# EAGLE schematic supply (EAGLE 7.4.0)
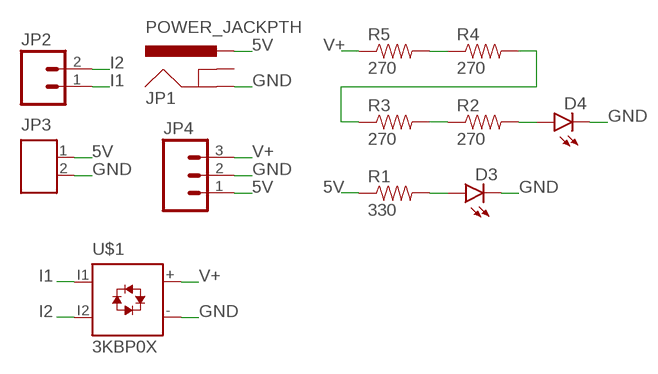
[diagram p0: schematic, sheet 1]

## Parts
D3  LED10MM  [LED10MM]
D4  LED10MM  [LED10MM]
JP1  POWER_JACKPTH  [POWER_JACK_PTH]
JP2  M025MM  [SCREWTERMINAL-5MM-2]
JP3  M02  [JST-2-PTH]
JP4  M03LONGPADS  [1X03_LONGPADS]
R1  330  1KOHM-1/4W-5%(PTH)HORIZ-KIT  [AXIAL-0.3EZ]
R2  270  1KOHM-1/4W-5%(PTH)HORIZ-KIT  [AXIAL-0.3EZ]
R3  270  1KOHM-1/4W-5%(PTH)HORIZ-KIT  [AXIAL-0.3EZ]
R4  270  1KOHM-1/4W-5%(PTH)HORIZ-KIT  [AXIAL-0.3EZ]
R5  270  1KOHM-1/4W-5%(PTH)HORIZ-KIT  [AXIAL-0.3EZ]
U$1  3KBP0X  [3KBP0X]

## Nets
5V: JP1.PWR JP3.1 JP4.1 R1.P$1
GND: D3.C D4.C JP1.GND JP3.2 JP4.2 U$1.-
I1: JP2.1 U$1.I1
I2: JP2.2 U$1.I2
N$1: R2.P$1 R3.P$2
N$2: R3.P$1 R4.P$2
N$3: D4.A R2.P$2
N$4: D3.A R1.P$2
N$5: R4.P$1 R5.P$2
V+: JP4.3 R5.P$1 U$1.+
Unconnected: JP1.GNDBREAK

## Library data of the parts
D3 D4 = SparkFun-LED:LED: LEDs Standard schematic elements and footprints for 5mm, 3mm, 1206, and 0603 sized LEDs. 5mm - Spark Fun Electronics SKU : COM-00529 (and others)
JP1 = SparkFun-Connectors:POWER_JACK: Power Jack This is the standard 5.5mm barrel jack for power. The PTH is the most common, proven, reliable, footprint. The Slot footprint only works if the mill layer is transmitted to the PCB fab house so be warned. Mating wall wart : TOL-00298 (and others); PROD_ID: CONN-08197
JP2 = SparkFun-Connectors:M02: Standard 2-pin 0.1" header. Use with - straight break away headers ( PRT-00116) - right angle break away headers (PRT-00553) - swiss pins (PRT-00743) - machine pins (PRT-00117) - female headers (PRT-00115) Molex polarized connector foot print use with: PRT-08233 with associated crimp pins and housings. 2.54_SCREWTERM for use with PRT-10571. 3.5mm Screw Terminal footprints for PRT-08084 5mm Screw Terminal footprints for use with PRT-08432; STOREFRONT_ID: PRT-08432
JP3 = custom-parts:M02
JP4 = SparkFun-Connectors:M03: Header 3 Standard 3-pin 0.1" header. Use with straight break away headers (SKU : PRT-00116), right angle break away headers (PRT-00553), swiss pins (PRT-00743), machine pins (PRT-00117), and female headers (PRT-00115). Molex polarized connector foot print use with SKU : PRT-08232 with associated crimp pins and housings.
R1-R5 = SparkFun-Resistors:1KOHM-1/4W-5%(PTH): RES-08380; PROD_ID: RES-08380; VALUE: 1k
U$1 = custom-parts:3KBP0X